# EAGLE board cblockyeesh (EAGLE 6.6.0), part 1 of 2
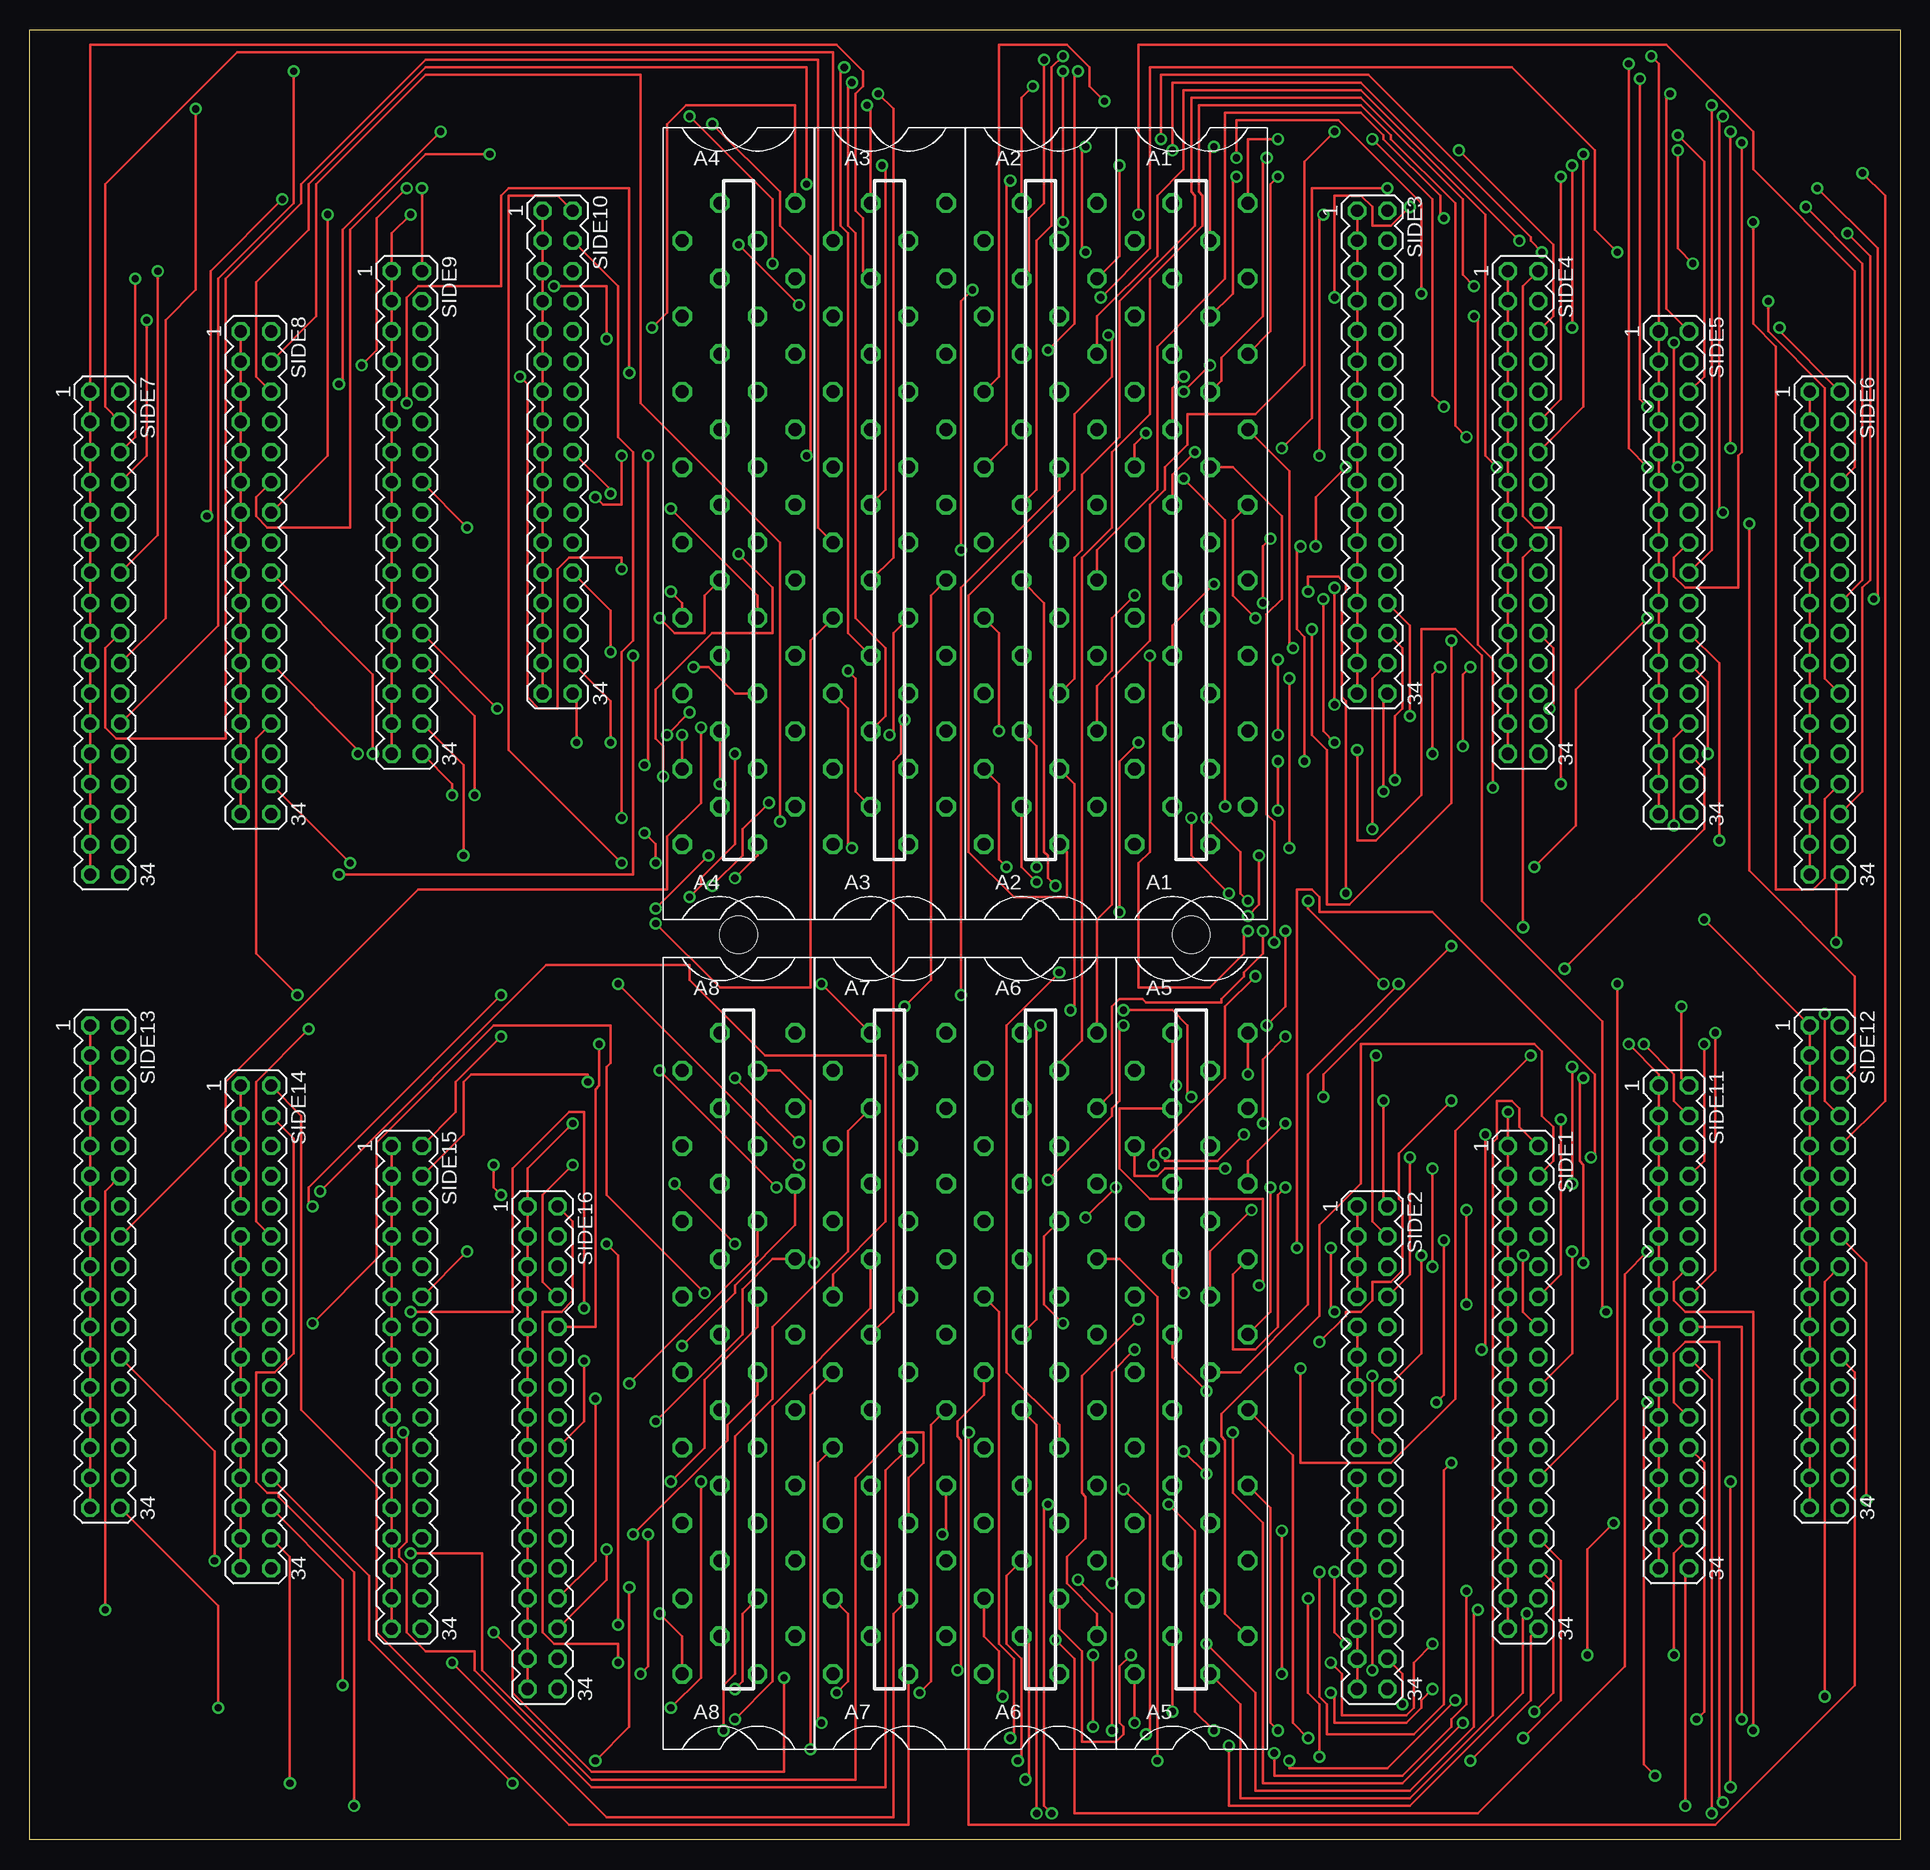
[diagram p1: board, top side]
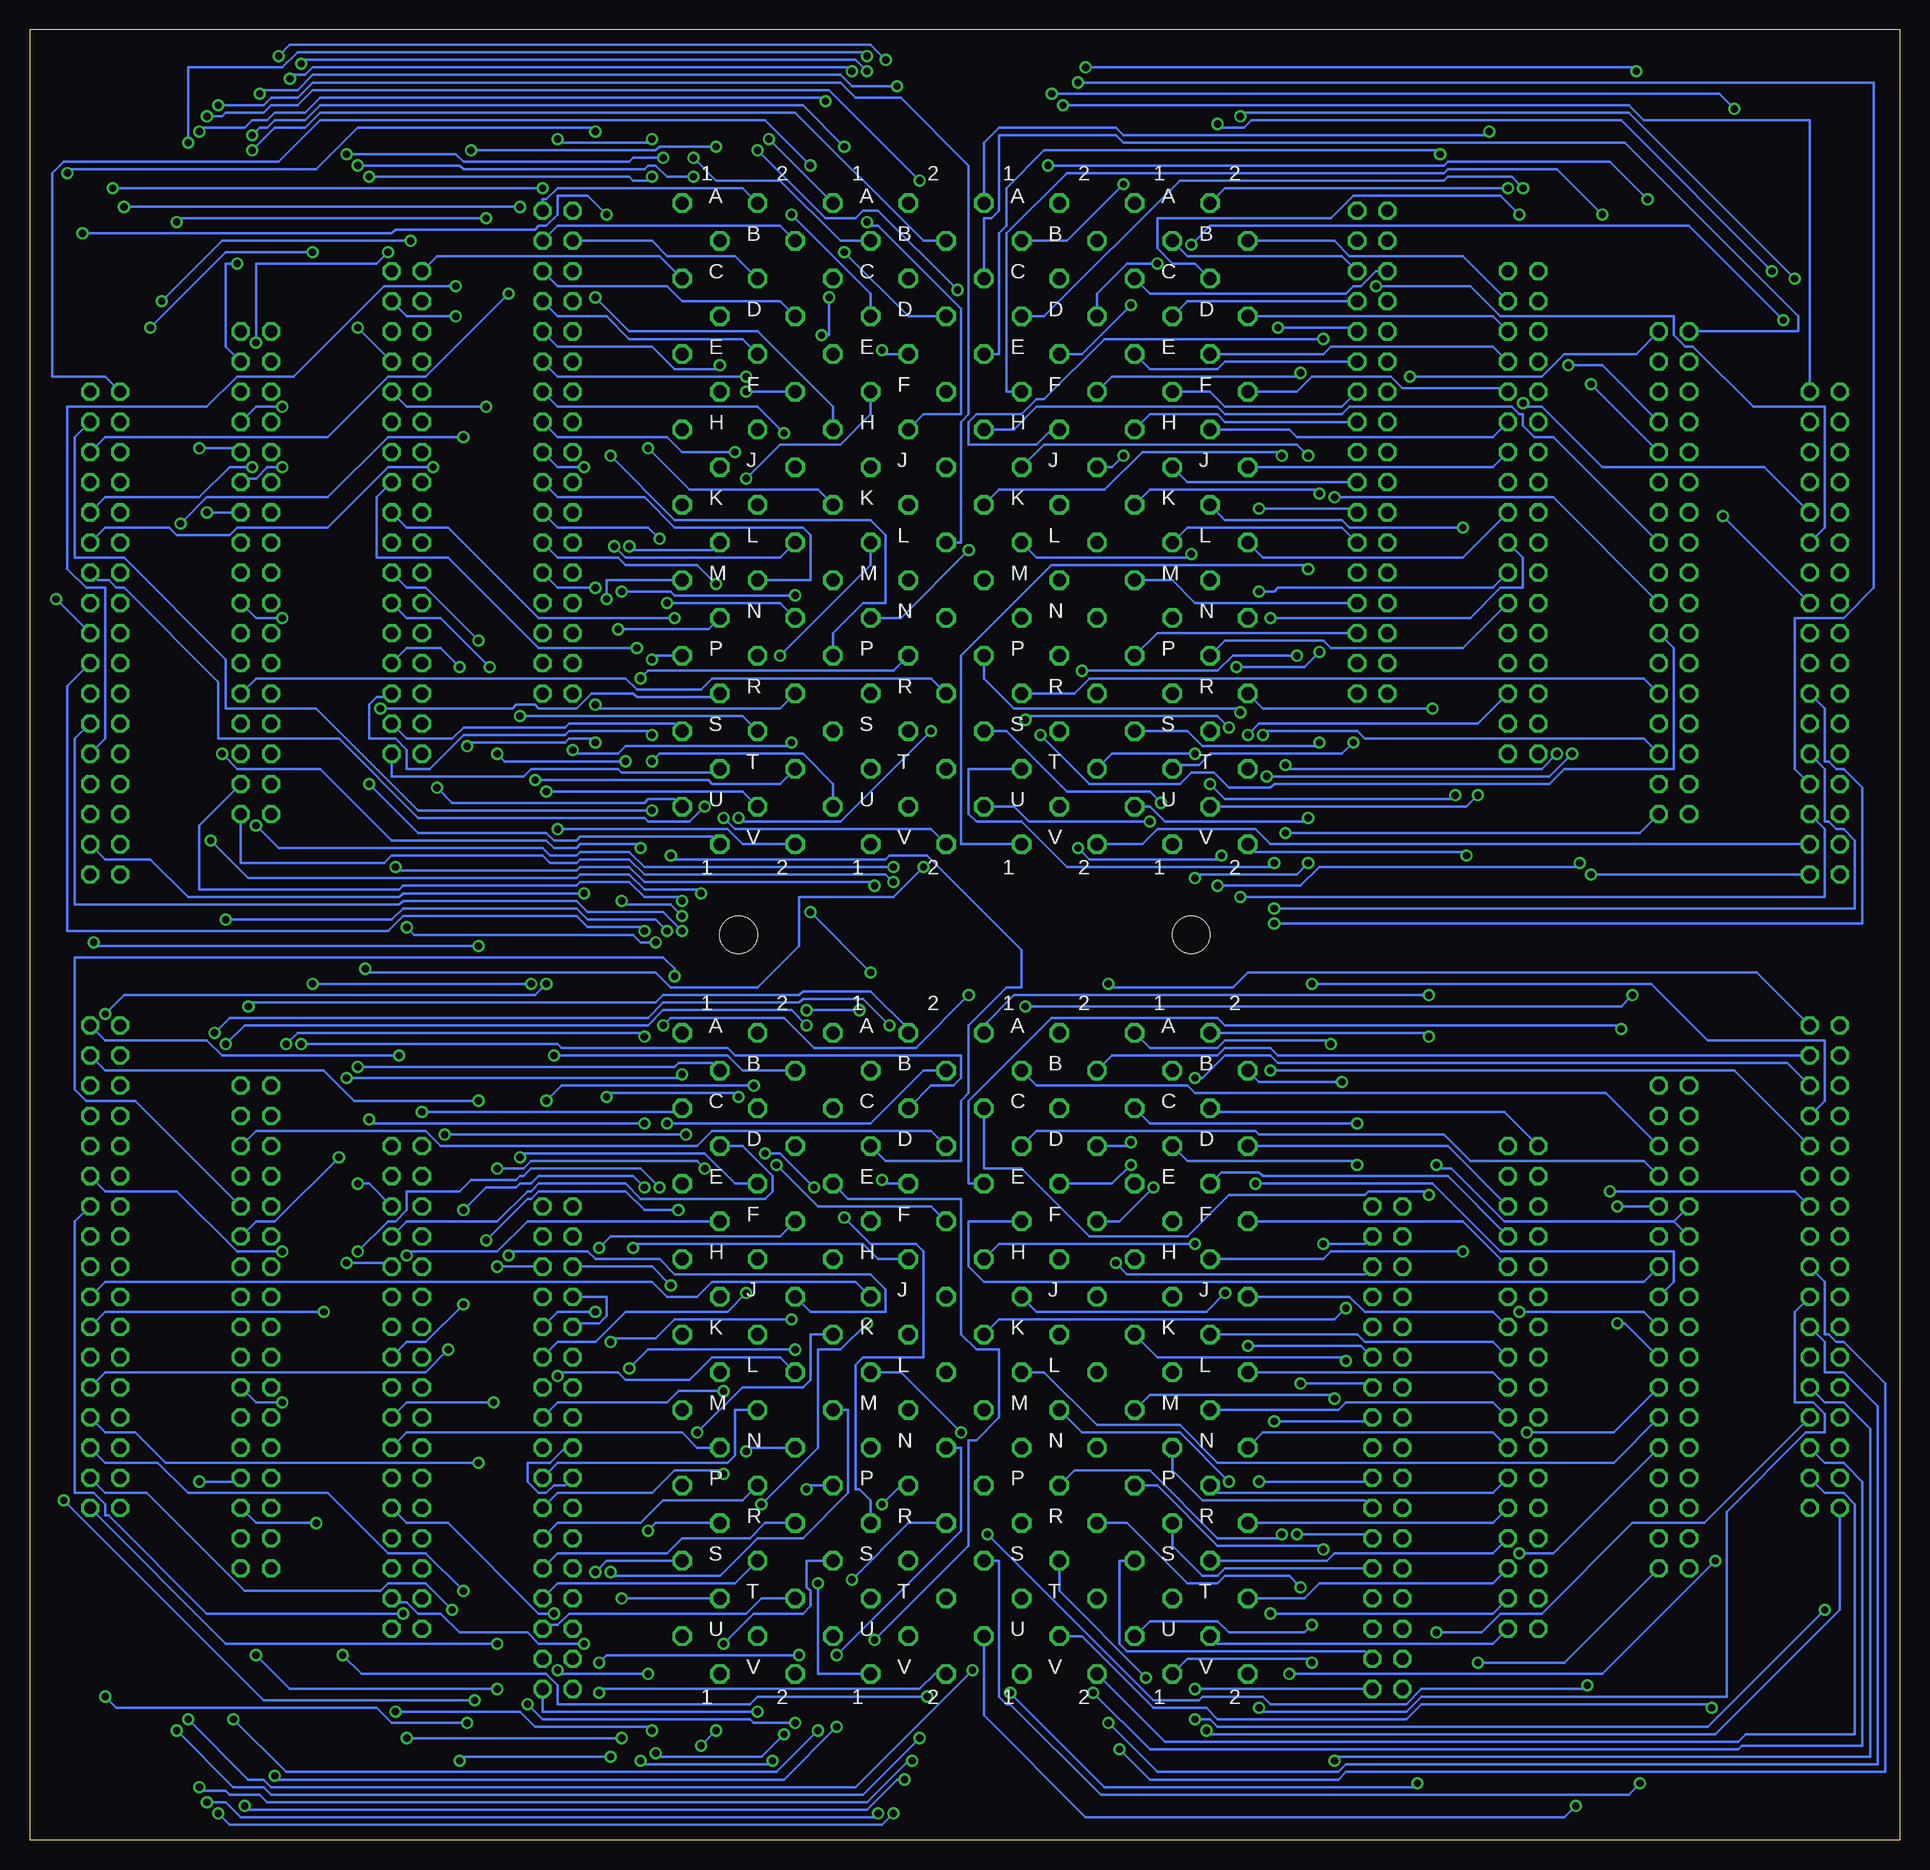
[diagram p2: board, bottom side, seen from below]

Size 157.48 x 152.4 mm. Coordinates in mm from the lower left corner, seen from the top.
Outline: 157.48,0 0,0 0,152.4 157.48,152.4 157.48,0
Copper layers (1*16): Top 0.035mm / dielectric 1.5mm / Bottom 0.035mm
Design rules "olimex8mil": minimum track width 8mil, minimum drill 24mil, track to track 8mil, track to pad 8mil, pad to pad 8mil, via to via 8mil, smd to smd 8mil, copper to edge 40mil, drill to drill 10mil, minimum pad ring 10mil, minimum via ring 8mil, stop-mask expansion 0mil, vias tented up to drill 0mil, thermal gap 10mil
Net classes: 1 Power: width 0.305 mm, clearance 0.305 mm
Holes 3.17 mm at 59.69,76.2 97.79,76.2
tKeepout: area 56.5,73 to 62.9,79.4; area 94.6,73 to 101,79.4

## Footprints (pad centres in the part's own frame; a part is rotated, then mirrored left to right if it is on the bottom)
H807 = drill 1.092 octagon: A1 4.763,28.575; A2 -1.587,28.575; B1 1.587,25.4; B2 -4.763,25.4; C1 4.763,22.225; C2 -1.587,22.225; D1 1.587,19.05; D2 -4.763,19.05; E1 4.763,15.875; E2 -1.587,15.875; F1 1.587,12.7; F2 -4.763,12.7; H1 4.763,9.525; H2 -1.587,9.525; J1 1.587,6.35; J2 -4.763,6.35; K1 4.763,3.175; K2 -1.587,3.175; L1 1.587,0; L2 -4.763,0; M1 4.763,-3.175; M2 -1.587,-3.175; N1 1.587,-6.35; N2 -4.763,-6.35; P1 4.763,-9.525; P2 -1.587,-9.525; R1 1.587,-12.7; R2 -4.763,-12.7; S1 4.763,-15.875; S2 -1.587,-15.875; T1 1.587,-19.05; T2 -4.763,-19.05; U1 4.763,-22.225; U2 -1.587,-22.225; V1 1.587,-25.4; V2 -4.763,-25.4
MA17-2 = drill 1.016 octagon: 1 -20.32,-1.27; 2 -20.32,1.27; 3 -17.78,-1.27; 4 -17.78,1.27; 5 -15.24,-1.27; 6 -15.24,1.27; 7 -12.7,-1.27; 8 -12.7,1.27; 9 -10.16,-1.27; 10 -10.16,1.27; 11 -7.62,-1.27; 12 -7.62,1.27; 13 -5.08,-1.27; 14 -5.08,1.27; 15 -2.54,-1.27; 16 -2.54,1.27; 17 0,-1.27; 18 0,1.27; 19 2.54,-1.27; 20 2.54,1.27; 21 5.08,-1.27; 22 5.08,1.27; 23 7.62,-1.27; 24 7.62,1.27; 25 10.16,-1.27; 26 10.16,1.27; 27 12.7,-1.27; 28 12.7,1.27; 29 15.24,-1.27; 30 15.24,1.27; 31 17.78,-1.27; 32 17.78,1.27; 33 20.32,-1.27; 34 20.32,1.27

## Placement (x,y rotation side)
A1  [H807]  97.79,109.22 0 top
A2  [H807]  85.09,109.22 0 top
A3  [H807]  72.39,109.22 0 top
A4  [H807]  59.69,109.22 0 top
A5  [H807]  97.79,39.37 0 top
A6  [H807]  85.09,39.37 0 top
A7  [H807]  72.39,39.37 0 top
A8  [H807]  59.69,39.37 0 top
SIDE1  [MA17-2]  125.73,38.1 270 top
SIDE2  [MA17-2]  113.03,33.02 270 top
SIDE3  [MA17-2]  113.03,116.84 270 top
SIDE4  [MA17-2]  125.73,111.76 270 top
SIDE5  [MA17-2]  138.43,106.68 270 top
SIDE6  [MA17-2]  151.13,101.6 270 top
SIDE7  [MA17-2]  6.35,101.6 270 top
SIDE8  [MA17-2]  19.05,106.68 270 top
SIDE9  [MA17-2]  31.75,111.76 270 top
SIDE10  [MA17-2]  44.45,116.84 270 top
SIDE11  [MA17-2]  138.43,43.18 270 top
SIDE12  [MA17-2]  151.13,48.26 270 top
SIDE13  [MA17-2]  6.35,48.26 270 top
SIDE14  [MA17-2]  19.05,43.18 270 top
SIDE15  [MA17-2]  31.75,38.1 270 top
SIDE16  [MA17-2]  43.18,33.02 270 top

## Tracks (layer width: path | path; a pad name or v marks a point on that pad's centre or on a via)
N$1  (via drill 0.61)
  Top 0.203: SIDE2.19 SIDE2.21 SIDE2.23 SIDE2.25 SIDE2.27 SIDE2.29 SIDE2.31 SIDE2.33 | SIDE2.17 SIDE2.15 SIDE2.13 SIDE2.11 SIDE2.9 | SIDE2.1 SIDE2.3 SIDE2.5 SIDE2.7 | A5.C2 91.76,61.59 91.76,56.52 94.3,53.98 103.82,53.98 103.82,46.99 v103.5,46.67
  Bottom 0.203: v103.5,46.67 105.09,48.26 SIDE2.5 | SIDE2.9 111.44,43.5 109.54,43.5 108.9,44.13 108.9,45.72 SIDE2.7 | SIDE2.19 112.39,29.84 113.35,29.84 113.98,29.21 114.62,29.21 115.57,30.16 115.57,31.75 113.67,31.75 112.39,33.02 SIDE2.17
N$2  (via drill 0.61)
  Top 0.203: SIDE2.2 113.98,53.66 v113.98,62.23 | v96.52,63.5 96.2,63.82 A5.A2
  Bottom 0.203: v113.98,62.23 112.71,63.5 v96.52,63.5
N$3  (via drill 0.61)
  Top 0.203: SIDE2.4 113.03,52.07 113.03,65.72 v113.35,66.04
  Bottom 0.203: v113.35,66.04 98.74,66.04 97.47,64.77 A5.B2
N$4  (via drill 0.61)
  Top 0.203: v118.11,56.52 v118.11,48.26 | v100.65,56.52 95.57,56.52 94.93,55.88 93.03,55.88 A5.D2
  Bottom 0.203: v118.11,48.26 SIDE2.6 | v118.11,56.52 115.89,56.52 115.25,57.15 101.28,57.15 v100.65,56.52
N$5  (via drill 0.61)
  Top 0.203: SIDE2.8 116.2,47.62 v116.2,57.47
  Bottom 0.203: v116.2,57.47 115.89,57.78 100.65,57.78 98.11,55.24 A5.E2
N$6  (via drill 0.61)
  Top 0.203: v109.86,44.45 109.54,44.77 v109.54,49.85
  Bottom 0.203: SIDE2.10 113.03,44.45 v109.86,44.45 | v109.54,49.85 108.58,50.8 94.3,50.8 A5.F2
N$7  (via drill 0.61)
  Top 0.203: v97.16,46.04 96.2,46.99 A5.H2
  Bottom 0.203: SIDE2.12 113.03,41.91 109.86,41.91 107.31,44.45 98.74,44.45 v97.16,46.04
N$8  (via drill 0.61)
  Top 0.203: SIDE2.14 117.16,40.96 v117.16,49.21
  Bottom 0.203: v117.16,49.21 116.84,49.53 110.49,49.53 109.86,48.9 104.46,48.9 103.19,47.62 86.68,47.62 85.41,46.35 85.41,44.45 91.76,44.45 A5.J2
N$9  (via drill 0.61)
  Top 0.203: v99.06,37.78 96.2,40.64 A5.K2
  Bottom 0.203: SIDE2.16 113.03,36.83 103.82,36.83 102.87,37.78 v99.06,37.78
N$10  (via drill 0.61)
  Top 0.203: SIDE2.18 113.03,34.29 v113.03,39.05
  Bottom 0.203: v113.03,39.05 112.71,39.37 107.95,39.37 107.31,38.73 101.92,38.73 100.01,40.64 94.3,40.64 A5.L2
N$11
  Bottom 0.203: SIDE2.20 113.03,31.75 98.74,31.75 98.11,32.38 98.11,36.2 A5.M2
N$12  (via drill 0.61)
  Top 0.203: v97.16,32.7 v99.06,30.8
  Bottom 0.203: SIDE2.22 113.03,29.21 105.09,29.21 103.19,31.11 99.38,31.11 v99.06,30.8 | v97.16,32.7 96.84,33.02 A5.N2
N$13
  Bottom 0.203: SIDE2.24 113.03,26.67 106.05,26.67 104.14,28.57 97.47,28.57 A5.P2
N$14
  Bottom 0.203: SIDE2.26 113.03,24.13 103.82,24.13 102.55,25.4 96.84,25.4 95.57,26.67 A5.R2
N$15
  Bottom 0.203: SIDE2.28 113.03,21.59 98.11,21.59 A5.S2
N$16
  Bottom 0.203: SIDE2.30 113.98,18.1 113.03,18.1 112.08,19.05 97.16,19.05 95.89,20.32 A5.T2
N$17  (via drill 0.61)
  Top 0.203: A5.U2 v96.2,10.79
  Bottom 0.203: SIDE2.34 114.3,10.79 v96.2,10.79
N$18  (via drill 0.61)
  Top 0.203: SIDE2.32 115.57,13.97 v115.57,11.43 | A5.V2 v93.03,9.84
  Bottom 0.203: v115.57,11.43 114.3,10.16 96.84,10.16 96.52,9.84 v93.03,9.84
N$19  (via drill 0.61)
  Top 0.203: v130.81,48.58 130.81,56.83 130.49,57.15 130.49,63.82 v130.81,64.14 | A5.A1 v102.55,64.45
  Bottom 0.203: SIDE1.10 127.32,48.58 v130.81,48.58 | v130.81,64.14 102.87,64.14 v102.55,64.45
N$20  (via drill 0.61)
  Top 0.203: v129.86,65.09 v129.86,55.24
  Bottom 0.203: SIDE1.6 128.91,55.24 v129.86,55.24 | v129.86,65.09 103.19,65.09 102.87,65.41 100.01,65.41 A5.B1
N$21
  Bottom 0.203: SIDE1.8 125.73,52.07 118.11,52.07 115.57,54.61 115.25,54.61 114.62,55.24 107.31,55.24 106.05,53.98 95.57,53.98 94.93,54.61 94.93,55.88 97.47,58.42 A5.D1
N$22  (via drill 0.61)
  Top 0.203: SIDE1.12 128.91,47.62 v128.91,60.64 | v105.73,60.33 102.55,57.15 A5.E1
  Bottom 0.203: v128.91,60.64 128.59,60.33 v105.73,60.33
N$23  (via drill 0.61)
  Top 0.203: SIDE1.14 125.73,44.45 v125.73,49.21
  Bottom 0.203: v125.73,49.21 125.41,49.53 118.11,49.53 115.57,52.07 A5.F1
N$24  (via drill 0.61)
  Top 0.203: v120.97,53.02 v120.97,45.09 | v105.73,54.93 105.09,54.29 105.09,43.18 103.19,41.27 101.28,41.27 101.28,47.62 A5.H1
  Bottom 0.203: SIDE1.16 125.73,41.91 124.14,41.91 v120.97,45.09 | v120.97,53.02 119.06,54.93 116.52,54.93 116.2,55.24 115.25,55.24 114.62,55.88 106.68,55.88 v105.73,54.93
N$25  (via drill 0.61)
  Top 0.203: v118.43,36.83 119.06,37.47 v119.06,50.48 | v102.87,53.02 99.38,49.53 A5.J1
  Bottom 0.203: SIDE1.20 125.73,36.83 v118.43,36.83 | v119.06,50.48 115.57,53.98 115.25,53.98 114.62,54.61 107.31,54.61 105.73,53.02 v102.87,53.02
N$26  (via drill 0.61)
  Top 0.203: SIDE1.18 129.86,40.96 v129.86,49.53 | v104.46,54.93 104.46,44.45 A5.K1
  Bottom 0.203: v129.86,49.53 127.32,52.07 126.68,52.07 125.73,53.02 125.73,54.61 121.28,54.61 120.33,55.56 116.52,55.56 116.2,55.88 115.89,55.88 115.25,56.52 106.05,56.52 v104.46,54.93
N$27  (via drill 0.61)
  Top 0.203: SIDE1.24 133.67,37.15 v133.67,72.07 | v115.25,72.07 107.63,64.45 107.63,45.09 101.92,39.37 A5.L1
  Bottom 0.203: v115.25,72.07 v133.67,72.07
N$28  (via drill 0.61)
  Top 0.203: SIDE1.28 128.91,23.5 128.91,11.75 v125.73,8.57 | v107.63,8.57 106.36,9.84 106.36,32.38 A5.M1
  Bottom 0.203: v107.63,8.57 v125.73,8.57
N$29
  Bottom 0.203: SIDE1.22 125.73,34.29 102.55,34.29 101.28,33.02 A5.N1
N$30  (via drill 0.61)
  Top 0.203: SIDE1.30 128.27,21.59 128.27,12.38 v126.68,10.79 | v105.09,9.21 104.46,9.84 104.46,27.94 A5.P1
  Bottom 0.203: v126.68,10.79 116.2,10.79 114.94,9.53 105.41,9.53 v105.09,9.21
N$31  (via drill 0.61)
  Top 0.203: v113.35,19.05 113.03,18.73 v113.03,14.29 | v105.41,26.04 v105.41,13.97
  Bottom 0.203: SIDE1.26 125.73,26.67 122.24,26.67 114.62,19.05 v113.35,19.05 | v113.03,14.29 112.71,13.97 v105.41,13.97 | v105.41,26.04 104.78,26.67 A5.R1
N$32  (via drill 0.61)
  Top 0.203: v110.81,16.51 109.86,17.46 v109.86,22.54
  Bottom 0.203: SIDE1.32 126.68,20 125.73,20 124.78,19.05 122.87,19.05 121.28,17.46 115.57,17.46 114.62,16.51 v110.81,16.51 | v109.86,22.54 108.9,23.5 A5.S1
N$33  (via drill 0.61)
  Top 0.203: SIDE1.34 126.36,17.14 126.36,11.75 v121.28,6.67 | v108.58,6.99 108.58,11.43 107.63,12.38 v107.63,20.32
  Bottom 0.203: v121.28,6.67 120.97,6.99 v108.58,6.99 | A5.T1 v107.63,20.32
N$34
  Top 0.203: SIDE1.4 128.27,57.15 128.27,60.01 127.32,60.96 127.32,66.36 126.68,66.99 112.08,66.99 112.08,55.24 108.58,51.75 108.58,44.13 100.33,35.88 100.33,33.97 100.65,33.66 100.65,19.05 A5.U1
N$35
  Top 0.203: SIDE1.2 125.41,60.01 125.41,61.59 124.78,62.23 123.51,62.23 123.51,59.05 123.19,58.74 123.19,10.48 116.2,3.49 101.92,3.49 101.92,11.43 A5.V1
N$36  (via drill 0.61)
  Top 0.203: v124.46,61.28 SIDE1.1 SIDE1.3 SIDE1.5 SIDE1.7 SIDE1.9 SIDE1.11 SIDE1.13 SIDE1.15 SIDE1.17 SIDE1.19 SIDE1.21 SIDE1.23 SIDE1.25 SIDE1.27 SIDE1.29 SIDE1.31 SIDE1.33
  Bottom 0.203: A5.C1 102.87,61.28 v124.46,61.28
N$37
  Top 0.203: SIDE3.1 SIDE3.3 SIDE3.5 SIDE3.7 SIDE3.9 SIDE3.11 SIDE3.13 SIDE3.15 SIDE3.17 SIDE3.19 SIDE3.21 SIDE3.23 SIDE3.25 SIDE3.27 SIDE3.29 SIDE3.31 SIDE3.33
  Bottom 0.203: A1.C2 98.11,133.35 103.82,133.35 105.09,134.62 SIDE3.3
N$38
  Bottom 0.203: SIDE3.2 114.3,138.11 113.98,138.11 113.03,139.06 97.47,139.06 A1.A2
N$39
  Bottom 0.203: SIDE3.4 113.03,135.89 94.3,135.89 A1.B2
N$40
  Bottom 0.203: SIDE3.6 113.03,130.81 103.82,130.81 102.55,129.54 94.3,129.54 A1.D2
N$41
  Bottom 0.203: SIDE3.8 113.03,128.27 108.9,128.27 107,126.36 97.47,126.36 A1.E2
N$42  (via drill 0.61)
  Top 0.203: v97.16,121.92 v99.38,124.14
  Bottom 0.203: SIDE3.10 113.03,125.73 105.09,125.73 103.19,123.83 99.69,123.83 v99.38,124.14 | A1.F2 v97.16,121.92
N$43  (via drill 0.61)
  Top 0.203: v97.16,123.19 96.2,122.24 A1.H2
  Bottom 0.203: SIDE3.12 113.03,123.19 v97.16,123.19
N$44  (via drill 0.61)
  Top 0.203: v93.98,118.43 93.03,117.47 A1.J2
  Bottom 0.203: SIDE3.14 113.03,120.65 96.2,120.65 v93.98,118.43
N$45  (via drill 0.61)
  Top 0.203: v98.11,116.84 96.2,114.94 A1.K2
  Bottom 0.203: SIDE3.16 113.03,118.11 103.82,118.11 102.55,116.84 v98.11,116.84
N$46  (via drill 0.61)
  Top 0.203: v110.81,115.57 108.27,113.03 v108.27,108.9
  Bottom 0.203: SIDE3.18 113.03,115.57 v110.81,115.57 | v108.27,108.9 107.31,107.95 94.3,107.95 A1.L2
N$47
  Bottom 0.203: SIDE3.20 113.03,113.03 105.73,113.03 103.19,110.49 92.39,110.49 91.76,109.86 91.76,106.05 A1.M2
N$48  (via drill 0.61)
  Top 0.203: v104.46,109.54 103.82,108.9 v103.82,104.14
  Bottom 0.203: SIDE3.22 113.03,110.49 105.41,110.49 v104.46,109.54 | v103.82,104.14 94.3,104.14 A1.N2
N$49  (via drill 0.61)
  Top 0.203: v99.69,105.73 96.2,102.23 A1.P2
  Bottom 0.203: SIDE3.24 113.03,107.95 107.95,107.95 107.31,107.31 101.28,107.31 v99.69,105.73
N$50  (via drill 0.61)
  Top 0.203: v109.86,95.57 v109.86,105.41
  Bottom 0.203: SIDE3.26 113.03,105.41 v109.86,105.41 | v109.86,95.57 109.54,95.25 94.3,95.25 A1.R2
N$51  (via drill 0.61)
  Top 0.203: SIDE3.28 116.2,102.23 v116.2,94.61
  Bottom 0.203: v116.2,94.61 97.47,94.61 A1.S2
N$52  (via drill 0.61)
  Top 0.203: SIDE3.30 115.57,100.33 115.57,95.25 114.94,94.61 v114.94,89.22
  Bottom 0.203: v114.94,89.22 100.33,89.22 100.01,88.9 94.3,88.9 A1.T2
N$53  (via drill 0.61)
  Top 0.203: SIDE3.34 113.98,96.2 v113.98,88.27
  Bottom 0.203: v113.98,88.27 97.47,88.27 A1.U2
N$54  (via drill 0.61)
  Top 0.203: SIDE3.32 113.03,97.79 v113.03,85.09
  Bottom 0.203: v113.03,85.09 98.74,85.09 97.47,83.82 A1.V2
N$55  (via drill 0.61)
  Top 0.203: v119.06,120.65 118.11,121.6 118.11,138.11 v113.03,143.19 | v105.09,143.19 102.55,143.19 A1.A1
  Bottom 0.203: SIDE4.10 125.73,120.65 v119.06,120.65 | v113.03,143.19 112.71,142.88 105.41,142.88 v105.09,143.19
N$56  (via drill 0.61)
  Top 0.203: SIDE4.6 128.27,128.27 128.27,134.3 v120.33,142.24 | v99.69,142.56 99.38,142.24 A1.B1
  Bottom 0.203: v120.33,142.24 104.78,142.24 104.46,142.56 v99.69,142.56
N$57  (via drill 0.61)
  Top 0.203: v129.86,140.97 v129.86,127.32 | v101.6,140.02 101.28,139.7 101.28,130.18 A1.D1
  Bottom 0.203: v129.86,127.32 SIDE4.8 | v129.86,140.97 121.28,140.97 120.97,140.65 105.73,140.65 105.41,140.97 104.78,140.97 103.82,140.02 v101.6,140.02
N$58  (via drill 0.61)
  Top 0.203: SIDE4.12 128.91,121.28 v128.91,140.02 | v105.09,140.02 104.46,139.38 104.46,127 A1.E1
  Bottom 0.203: v128.91,140.02 107,140.02 106.68,139.7 105.41,139.7 v105.09,140.02
N$59  (via drill 0.61)
  Top 0.203: SIDE4.14 130.81,120.65 v130.81,141.92 | v104.14,141.6 103.82,141.29 103.82,128.27 100.33,124.78 100.33,122.87 A1.F1
  Bottom 0.203: v130.81,141.92 121.6,141.92 120.97,141.29 107,141.29 106.68,141.6 v104.14,141.6
N$60  (via drill 0.61)
  Top 0.203: v106.36,100.33 106.05,100.65 106.05,115.25 A1.H1
  Bottom 0.203: SIDE4.16 128.27,113.03 128.27,107.95 122.24,107.95 114.62,100.33 v106.36,100.33
N$61  (via drill 0.61)
  Top 0.203: SIDE4.20 125.73,107.95 v125.73,76.83 | v104.78,75.56 104.78,85.72 104.14,86.36 104.14,103.19 105.41,104.46 105.41,111.44 101.28,115.57 A1.J1
  Bottom 0.203: v125.73,76.83 125.09,76.2 106.68,76.2 106.05,75.56 v104.78,75.56
N$62  (via drill 0.61)
  Top 0.203: v103.19,102.87 101.28,104.78 101.28,111.12 A1.K1
  Bottom 0.203: SIDE4.18 125.73,110.49 122.24,110.49 114.62,102.87 v103.19,102.87
N$63  (via drill 0.61)
  Top 0.203: v118.75,98.74 118.11,98.11 v118.11,91.44 | v107.31,90.81 107.31,101.28 106.68,101.92 106.68,108.58 v107,108.9
  Bottom 0.203: SIDE4.24 125.73,102.87 122.87,102.87 v118.75,98.74 | v118.11,91.44 117.47,90.81 v107.31,90.81 | v107,108.9 106.68,108.58 100.01,108.58 A1.L1
N$64  (via drill 0.61)
  Top 0.203: v121.28,98.74 120.65,98.11 v120.65,92.08 | v109.86,92.39 108.9,93.34 v108.9,104.46
  Bottom 0.203: SIDE4.28 125.73,100.33 122.87,100.33 v121.28,98.74 | v120.65,92.08 120.33,92.39 112.39,92.39 112.08,92.71 110.17,92.71 v109.86,92.39 | v108.9,104.46 108.9,106.05 A1.M1
N$65  (via drill 0.61)
  Top 0.203: v119.7,100.97 119.7,87.31 111.12,78.74 109.22,78.74 109.22,91.76 107.95,93.03 v107.95,101.92
  Bottom 0.203: SIDE4.22 125.73,105.41 124.14,105.41 v119.7,100.97 | v107.95,101.92 100.33,101.92 A1.N1
N$66  (via drill 0.61)
  Top 0.203: v105.09,99.38 v105.09,93.03
  Bottom 0.203: SIDE4.30 127.32,96.2 128.27,96.2 128.91,95.57 128.91,92.71 126.68,92.71 125.73,91.76 125.73,90.17 123.83,90.17 120.97,93.03 112.39,93.03 112.08,93.34 105.41,93.34 v105.09,93.03 | v105.09,99.38 104.78,99.69 A1.P1
N$67  (via drill 0.61)
  Top 0.203: SIDE4.26 128.27,100.33 128.27,95.57 v127.95,95.25
  Bottom 0.203: v127.95,95.25 116.84,95.25 116.52,95.57 114.94,95.57 114.62,95.25 111.44,95.25 110.17,96.52 106.68,96.52 106.36,96.2 99.69,96.2 A1.R1
N$68
  Bottom 0.203: SIDE4.32 125.73,92.71 121.92,92.71 120.97,93.66 112.39,93.66 112.08,93.98 103.19,93.98 A1.S1
N$69
  Bottom 0.203: SIDE4.34 127,89.53 115.89,89.53 115.25,90.17 107.95,90.17 107.63,89.85 99.69,89.85 A1.T1
N$70  (via drill 0.61)
  Top 0.203: v121.6,128.27 121.92,127.95 121.92,100.65 123.19,99.38 v123.19,88.58
  Bottom 0.203: SIDE4.4 125.73,128.27 v121.6,128.27 | v123.19,88.58 121.92,87.31 105.73,87.31 105.41,87.63 103.19,87.63 A1.U1
N$71  (via drill 0.61)
  Top 0.203: SIDE4.2 125.73,130.81 125.73,111.44 126.68,110.49 128.91,110.49 v128.91,88.9
  Bottom 0.203: v128.91,88.9 124.78,84.77 113.98,84.77 113.35,84.14 111.44,84.14 111.12,84.45 100.01,84.45 A1.V1
N$72
  Top 0.203: SIDE4.1 SIDE4.3 SIDE4.5 SIDE4.7 SIDE4.9 SIDE4.11 SIDE4.13 SIDE4.15 SIDE4.17 SIDE4.19 SIDE4.21 SIDE4.23 SIDE4.25 SIDE4.27 SIDE4.29 SIDE4.31 SIDE4.33
  Bottom 0.203: A1.C1 104.46,133.35 123.19,133.35 SIDE4.1
N$73  (via drill 0.61)
  Top 0.203: SIDE5.33 SIDE5.31 SIDE5.29 SIDE5.27 SIDE5.25 SIDE5.23 SIDE5.21 SIDE5.19 SIDE5.17 SIDE5.15 SIDE5.13 SIDE5.11 SIDE5.9 SIDE5.7 SIDE5.5 SIDE5.3 SIDE5.1 137.16,149.54 v136.53,150.18 | A2.C2 84.14,132.08 84.14,136.53 85.41,137.79 v85.41,149.86
  Bottom 0.203: v85.41,149.86 86.68,151.13 135.57,151.13 v136.53,150.18
N$74  (via drill 0.61)
  Top 0.203: SIDE5.2 137.79,128.91 137.79,146.69 v138.11,147 | v84.45,147.64 83.5,146.69 A2.A2
  Bottom 0.203: v138.11,147 137.79,147.32 134.94,147.32 133.67,148.59 89.22,148.59 88.27,147.64 v84.45,147.64
N$75  (via drill 0.61)
  Top 0.203: v140.02,132.72 138.75,133.99 v138.75,142.24
  Bottom 0.203: SIDE5.4 140.97,125.73 140.97,132.72 v140.02,132.72 | v138.75,142.24 136.84,144.15 134.3,144.15 133.03,145.41 93.03,145.41 82.23,134.62 A2.B2
N$76  (via drill 0.61)
  Top 0.203: SIDE5.6 140.97,123.19 140.97,141.29 v138.75,143.51 | v88.9,142.56 88.58,142.24 88.58,133.99 v88.9,133.67
  Bottom 0.203: v138.75,143.51 138.11,144.15 137.48,144.15 136.84,144.78 134.3,144.78 133.03,146.05 92.39,146.05 v88.9,142.56 | v88.9,133.67 83.5,128.27 A2.D2
N$77  (via drill 0.61)
  Top 0.203: v136.21,120.65 135.57,121.28 v135.57,148.27 | v88.27,148.91 87.95,148.59 87.95,127.64 v85.72,125.41
  Bottom 0.203: SIDE5.8 138.43,120.65 v136.21,120.65 | v135.57,148.27 135.25,148.59 134.3,148.59 133.67,149.22 88.58,149.22 v88.27,148.91 | v85.72,125.41 85.41,125.09 A2.E2
N$78  (via drill 0.61)
  Top 0.203: v143.19,143.83 v143.19,117.16 | v90.49,146.37 89.22,147.64 89.22,149.22 87.31,151.13 81.6,151.13 81.6,123.19 A2.F2
  Bottom 0.203: SIDE5.10 140.02,117.16 v143.19,117.16 | v143.19,143.83 142.88,144.15 139.38,144.15 138.75,144.78 137.48,144.78 136.84,145.41 134.3,145.41 133.03,146.69 90.81,146.69 v90.49,146.37
N$79  (via drill 0.61)
  Top 0.203: v136.21,115.57 134.62,117.16 v134.62,149.54 | v87,136.21 v87,148.91
  Bottom 0.203: SIDE5.12 139.38,114.62 138.43,114.62 137.48,115.57 v136.21,115.57 | v134.62,149.54 134.3,149.86 87.95,149.86 v87,148.91 | v87,136.21 86.68,135.89 86.04,135.89 79.06,128.91 79.06,120.02 82.23,120.02 A2.H2
N$80  (via drill 0.61)
  Top 0.203: v142.56,111.76 142.24,112.08 142.24,144.78 v142.56,145.1 | v82.55,139.7 82.23,139.38 82.23,117.47 A2.J2
  Bottom 0.203: v142.56,111.76 SIDE5.14 | v142.56,145.1 141.29,145.1 140.97,145.41 137.79,145.41 137.16,146.05 134.94,146.05 133.67,147.32 90.17,147.32 v82.55,139.7
N$81  (via drill 0.61)
  Top 0.203: SIDE5.16 138.43,107.95 138.43,106.36 139.38,105.41 143.83,105.41 143.83,116.52 144.15,116.84 v144.15,142.88 | v87,150.18 86.04,149.22 86.04,135.89 84.77,134.62 84.77,113.67 A2.K2
  Bottom 0.203: v144.15,142.88 144.15,149.22 136.21,149.22 134.94,150.5 87.31,150.5 v87,150.18
N$82  (via drill 0.61)
  Top 0.203: SIDE5.18 141.6,108.58 v141.6,146.05
  Bottom 0.203: v141.6,146.05 137.79,146.05 137.16,146.69 134.94,146.69 133.67,147.96 89.22,147.96 87.95,146.69 84.14,146.69 78.42,140.97 78.42,120.02 79.06,119.38 79.06,109.22 A2.L2
N$83  (via drill 0.61)
  Top 0.203: v136.21,102.87 130.18,96.84 130.18,85.41 v126.68,81.92 | v86.36,80.33 85.72,80.96 85.72,82.87 85.41,83.19 85.41,104.14 A2.M2
  Bottom 0.203: SIDE5.20 138.43,102.87 v136.21,102.87 | v126.68,81.92 126.36,81.6 111.44,81.6 111.12,81.92 107,81.92 105.73,80.64 86.68,80.64 v86.36,80.33
N$84  (via drill 0.61)
  Top 0.203: SIDE5.22 142.24,99.06 v142.24,84.14 | v100.97,79.69 97.79,82.87 v97.79,86.04 | v81.6,93.34 81.6,101.6 A2.N2
  Bottom 0.203: v142.24,84.14 139.06,80.96 111.44,80.96 111.12,81.28 107,81.28 105.73,80.01 101.28,80.01 v100.97,79.69 | v97.79,86.04 97.47,85.72 89.22,85.72 v81.6,93.34
N$85  (via drill 0.61)
  Top 0.203: SIDE5.24 141.29,97.47 v141.29,91.44 | v106.05,97.79 v106.05,83.5
  Bottom 0.203: v141.29,91.44 140.02,90.17 133.03,90.17 127,84.14 113.98,84.14 113.35,83.5 111.44,83.5 111.12,83.82 106.36,83.82 v106.05,83.5 | v106.05,97.79 105.41,98.42 84.77,98.42 A2.P2
N$86
  Bottom 0.203: SIDE5.26 138.43,97.79 107.31,97.79 106.36,96.84 100.97,96.84 100.01,97.79 81.6,97.79 A2.R2
N$87  (via drill 0.61)
  Top 0.203: SIDE5.28 138.43,92.71 v138.43,85.41 | v84.77,81.92 84.77,92.08 A2.S2
  Bottom 0.203: v138.43,85.41 136.53,83.5 114.3,83.5 113.67,82.87 111.44,82.87 111.12,83.19 107,83.19 105.73,81.92 v84.77,81.92
N$88  (via drill 0.61)
  Top 0.203: SIDE5.30 140.97,90.17 140.97,85.09 v129.22,73.34 | v82.23,81.92 81.6,82.55 81.6,88.9 A2.T2
  Bottom 0.203: v129.22,73.34 128.91,73.03 104.78,73.03 103.5,71.75 96.2,71.75 92.71,75.25 92.71,79.38 84.77,79.38 v82.23,81.92
N$89  (via drill 0.61)
  Top 0.203: v84.77,80.64 83.5,81.92 A2.U2
  Bottom 0.203: SIDE5.34 139.7,82.23 127.64,82.23 127,82.87 114.3,82.87 113.67,82.23 111.44,82.23 111.12,82.55 107,82.55 105.73,81.28 85.41,81.28 v84.77,80.64
N$90  (via drill 0.61)
  Top 0.203: v102.55,79.06 101.92,79.69 101.92,83.19 v99.06,86.04
  Bottom 0.203: SIDE5.32 143.19,85.41 143.19,80.01 126.36,80.01 126.05,80.33 111.44,80.33 111.12,80.64 107,80.64 105.73,79.38 102.87,79.38 v102.55,79.06 | v99.06,86.04 98.11,85.09 81.6,85.09 A2.V2
N$91  (via drill 0.61)
  Top 0.203: v138.75,115.57 138.43,115.89 v138.43,126.05 | v127.32,133.67 126.36,134.62 126.36,134.94 112.71,148.59 95.25,148.59 v95.25,143.19
  Bottom 0.203: SIDE6.10 151.13,113.03 143.19,113.03 140.65,115.57 v138.75,115.57 | v138.43,126.05 138.43,132.72 128.27,132.72 v127.32,133.67 | A2.A1 v95.25,143.19
N$92  (via drill 0.61)
  Top 0.203: v117.16,130.18 117.16,137.79 110.17,144.78 101.6,144.78 v101.6,141.6
  Bottom 0.203: SIDE6.6 151.13,118.11 132.4,118.11 127.32,123.19 124.14,123.19 v117.16,130.18 | v101.6,141.6 99.69,139.7 94.3,139.7 89.22,134.62 A2.B1
N$93  (via drill 0.61)
  Top 0.203: SIDE6.8 153.67,115.57 153.67,132.08 145.1,140.65 145.1,143.83 137.79,151.13 93.34,151.13 v93.34,136.84
  Bottom 0.203: v93.34,136.84 86.68,130.18 A2.D1
N$94  (via drill 0.61)
  Top 0.203: v123.51,115.57 122.56,116.52 122.56,136.84 112.08,147.32 97.16,147.32 97.16,140.65 94.93,138.43 94.93,133.35 89.85,128.27 A2.E1
  Bottom 0.203: SIDE6.12 151.13,110.49 145.73,110.49 145.1,109.86 140.65,109.86 140.02,110.49 132.4,110.49 127.32,115.57 v123.51,115.57
N$95  (via drill 0.61)
  Top 0.203: v100.65,87 100.65,111.12 v97.16,114.62
  Bottom 0.203: SIDE6.14 151.76,106.05 150.81,106.05 150.18,105.41 149.54,105.41 141.6,97.47 141.6,92.71 131.44,92.71 124.78,86.04 105.73,86.04 105.41,85.72 101.92,85.72 v100.65,87 | v97.16,114.62 94.3,117.47 89.22,117.47 86.68,120.02 A2.F1
N$96  (via drill 0.61)
  Top 0.203: SIDE6.16 154.31,106.05 154.31,132.72 v149.54,137.48 | v116.2,137.48 114.62,135.89 113.03,135.89 113.03,137.48 112.08,138.43 109.86,138.43 v109.86,129.86
  Bottom 0.203: v116.2,137.48 v149.54,137.48 | v109.86,129.86 107,127 96.2,127 89.85,120.65 A2.H1
N$97  (via drill 0.61)
  Top 0.203: v105.73,76.52 105.73,70.17 v104.14,68.58 | v78.42,71.12 78.42,105.41 86.68,113.67 A2.J1
  Bottom 0.203: SIDE6.20 154.31,97.16 154.31,76.52 127.32,76.52 126.05,77.79 111.44,77.79 110.49,76.83 106.05,76.83 v105.73,76.52 | v104.14,68.58 103.5,69.22 93.98,69.22 91.44,66.67 82.87,66.67 v78.42,71.12
N$98  (via drill 0.61)
  Top 0.203: v155.26,104.46 155.57,104.78 155.57,133.99 v150.5,139.06 | v114.3,139.06 107.95,139.06 107.95,119.7 v105.41,117.16
  Bottom 0.203: v155.26,104.46 SIDE6.18 | v114.3,139.06 v150.5,139.06 | v105.41,117.16 101.92,113.67 91.12,113.67 A2.K1
N$99  (via drill 0.61)
  Top 0.203: v102.55,76.52 102.23,76.2 102.23,74.61 99.38,71.75 93.34,71.75 93.34,82.23 94.3,83.19 v94.3,99.69
  Bottom 0.203: SIDE6.24 153.67,92.71 153.67,78.74 126.36,78.74 126.05,79.06 111.44,79.06 110.49,78.11 104.14,78.11 v102.55,76.52 | v94.3,99.69 86.68,107.31 A2.L1
N$100  (via drill 0.61)
  Top 0.203: SIDE6.28 151.13,87.63 151.13,80.96 150.18,80.01 147,80.01 147,125.73 145.1,127.64 v145.1,136.21 | v119.06,136.53 118.75,136.84 118.75,138.43 113.98,143.19 113.98,143.51 112.08,145.41 100.65,145.41 100.65,131.44 94.93,125.73 94.93,113.67 89.85,108.58 A2.M1
  Bottom 0.203: v145.1,136.21 144.78,136.53 v119.06,136.53
N$101  (via drill 0.61)
  Top 0.203: SIDE6.22 151.13,97.79 151.13,122.24 146.37,127 v146.37,129.54 | v125.41,134.62 112.08,147.96 96.2,147.96 v96.2,142.24 | v79.38,130.49 78.42,129.54 v78.42,108.58
  Bottom 0.203: v146.37,129.54 141.29,134.62 v125.41,134.62 | v96.2,142.24 90.49,136.53 87.95,136.53 87.31,137.16 86.04,137.16 v79.38,130.49 | v78.42,108.58 84.14,102.87 A2.N1
N$102  (via drill 0.61)
  Top 0.203: SIDE6.30 154.31,88.27 154.31,105.41 154.94,106.05 154.94,133.35 v153.03,135.25 | v108.9,136.84 108.58,136.53 v108.58,116.52
  Bottom 0.203: v153.03,135.25 127,135.25 126.68,135.57 114.94,135.57 114.62,135.89 113.98,135.89 113.03,136.84 113.03,138.43 110.49,138.43 v108.9,136.84 | v108.58,116.52 103.19,111.12 86.68,111.12 85.41,109.86 85.41,104.14 87.31,104.14 89.85,101.6 A2.P1
N$103  (via drill 0.61)
  Top 0.203: v121.6,130.81 120.65,131.76 120.65,138.11 112.08,146.69 97.79,146.69 97.79,138.75 98.11,138.43 98.11,135.89 91.76,129.54 91.76,118.11 88.58,114.94 88.58,108.58 87.95,107.95 87.95,97.79 A2.R1
  Bottom 0.203: SIDE6.26 151.13,92.71 151.13,105.41 152.72,105.41 154.31,107 154.31,120.65 142.56,120.65 140.02,123.19 135.25,123.19 127.64,130.81 v121.6,130.81
N$104  (via drill 0.61)
  Top 0.203: v110.81,79.69 110.81,95.89 110.49,96.2 110.49,104.78 110.81,105.09 110.81,105.73 110.17,106.36 107.63,106.36 v107.63,105.09 | v93.03,104.78 91.12,102.87 91.12,98.42 89.85,97.16 A2.S1
  Bottom 0.203: SIDE6.32 151.13,82.55 147.32,82.55 144.15,79.38 126.36,79.38 126.05,79.69 v110.81,79.69 | v107.63,105.09 103.5,105.09 103.19,104.78 v93.03,104.78
N$105  (via drill 0.61)
  Top 0.203: SIDE6.34 152.08,80.96 v152.08,75.56 | v119.7,75.25 108.9,64.45 v108.9,62.55 | v97.79,62.55 97.47,62.87 97.47,68.58 96.2,69.85 v92.08,69.85 | v87.63,69.85 87.95,70.17 87.95,88.9 A2.T1
  Bottom 0.203: v152.08,75.56 151.76,75.25 v119.7,75.25 | v108.9,62.55 108.58,62.87 98.11,62.87 v97.79,62.55 | v87.63,69.85 v92.08,69.85
N$106  (via drill 0.61)
  Top 0.203: v105.09,90.81 v105.09,86.68
  Bottom 0.203: SIDE6.4 153.67,118.11 153.67,107.95 149.54,107.95 140.97,99.38 140.97,95.25 133.35,95.25 124.78,86.68 v105.09,86.68 | v105.09,90.81 104.46,91.44 92.39,91.44 89.85,88.9 A2.U1
N$107  (via drill 0.61)
  Top 0.203: SIDE6.2 147.32,127 v147.32,127.32 | v133.67,133.67 131.76,135.57 131.76,142.24 124.78,149.22 94.3,149.22 94.3,133.99 v90.17,129.86 | v90.81,126.68 91.12,126.36 91.12,123.19 87.95,120.02 87.95,113.67 79.06,104.78 79.06,83.19 82.87,79.38 87.31,79.38 87.31,83.19 A2.V1
  Bottom 0.203: v147.32,127.32 140.97,133.67 v133.67,133.67 | v90.17,129.86 90.17,126.68 v90.81,126.68
N$108  (via drill 0.61)
  Top 0.203: SIDE6.33 SIDE6.31 SIDE6.29 SIDE6.27 SIDE6.25 SIDE6.23 SIDE6.21 SIDE6.19 SIDE6.17 SIDE6.15 SIDE6.13 SIDE6.11 SIDE6.9 SIDE6.7 SIDE6.5 SIDE6.3 SIDE6.1 | A2.C1 91.76,133.35 v91.76,140.97
  Bottom 0.203: v91.76,140.97 95.57,144.78 133.03,144.78 136.53,141.29 154.62,141.29 155.57,140.34 155.57,123.19 151.13,123.19 SIDE6.1
N$109
  Top 0.203: SIDE7.33 SIDE7.31 SIDE7.29 SIDE7.27 SIDE7.25 SIDE7.23 SIDE7.21 SIDE7.19 SIDE7.17 SIDE7.15 SIDE7.13 SIDE7.11 SIDE7.9 SIDE7.7 SIDE7.5 SIDE7.3 SIDE7.1 5.08,151.13 67.94,151.13 70.17,148.91 70.17,147.64 69.53,147 69.53,137.16 70.17,136.53 70.17,132.08 A3.C2
N$110  (via drill 0.61)
  Top 0.203: v70.48,146.05 70.8,145.73 A3.A2
  Bottom 0.203: SIDE7.2 7.62,144.78 21.59,144.78 22.86,146.05 v70.48,146.05
N$111
  Top 0.203: SIDE7.4 6.35,120.65 6.35,139.38 17.46,150.5 67.63,150.5 A3.B2
N$112  (via drill 0.61)
  Top 0.203: SIDE7.6 8.89,118.11 v8.89,131.44 | v55.56,145.1 62.55,138.11 v62.55,132.72
  Bottom 0.203: v8.89,131.44 22.86,145.41 55.24,145.41 v55.56,145.1 | v62.55,132.72 65.09,132.72 67.63,130.18 A3.D2
N$113  (via drill 0.61)
  Top 0.203: SIDE7.8 9.84,116.52 v9.84,127.95 | v64.77,129.22 v59.69,134.3
  Bottom 0.203: v9.84,127.95 17.78,135.89 58.1,135.89 v59.69,134.3 | v64.77,129.22 68.9,125.09 A3.E2
N$114  (via drill 0.61)
  Top 0.203: v31.75,120.97 31.75,129.86 32.7,130.81 39.69,130.81 39.69,138.43 40.32,139.06 50.48,139.06 v50.48,123.51
  Bottom 0.203: SIDE7.10 11.43,115.57 25.08,115.57 30.16,120.65 31.43,120.65 v31.75,120.97 | v50.48,123.51 50.8,123.19 66.36,123.19 A3.F2
N$115  (via drill 0.61)
  Top 0.203: v44.13,130.81 48.58,130.81 v48.58,126.36
  Bottom 0.203: SIDE7.12 6.35,110.49 6.35,120.65 12.38,120.65 17.46,125.73 18.1,125.73 19.05,126.68 19.05,128.27 33.66,128.27 36.2,130.81 v44.13,130.81 | v48.58,126.36 66.99,126.36 72.07,121.28 72.71,121.28 73.98,120.02 77.79,120.02 78.42,119.38 78.42,117.47 72.71,117.47 71.44,118.75 A3.H2
N$116  (via drill 0.61)
  Top 0.203: SIDE7.14 10.79,109.86 v10.79,132.08 | v57.47,144.46 63.18,138.75 63.18,135.89 65.72,133.35 65.72,116.84 v65.41,116.52
  Bottom 0.203: v10.79,132.08 23.5,144.78 54.61,144.78 55.24,144.15 57.15,144.15 v57.47,144.46 | v65.41,116.52 66.36,115.57 A3.J2
N$117  (via drill 0.61)
  Top 0.203: v14.92,111.44 15.24,111.76 15.24,132.08 v21.27,138.11 | v71.75,140.97 72.07,140.65 72.07,113.67 A3.K2
  Bottom 0.203: v14.92,111.44 SIDE7.16 | v21.27,138.11 24.45,141.29 38.1,141.29 38.42,140.97 v71.75,140.97
N$118
  Top 0.203: SIDE7.18 6.35,100.33 6.35,93.66 7.3,92.71 16.51,92.71 16.51,131.44 22.86,137.79 22.86,139.38 33.34,149.86 66.36,149.86 66.36,110.49 A3.L2
N$119  (via drill 0.61)
  Top 0.203: SIDE7.20 11.43,102.87 11.43,127.95 13.97,130.49 v13.97,145.73 | v71.44,147 72.71,145.73 72.71,107.95 A3.M2
  Bottom 0.203: v13.97,145.73 15.24,147 v71.44,147
N$120  (via drill 0.61)
  Top 0.203: v52.7,77.15 58.1,71.75 65.72,71.75 65.72,100.97 A3.N2
  Bottom 0.203: SIDE7.22 6.35,95.25 6.35,90.81 6.03,90.81 5.4,90.17 4.76,90.17 3.17,88.58 3.17,77.15 v52.7,77.15
N$121  (via drill 0.61)
  Top 0.203: SIDE7.24 15.88,102.23 15.88,131.44 22.23,137.79 v22.23,148.91 | v68.58,149.22 68.26,148.91 68.26,135.89 68.9,135.25 68.9,101.6 A3.P2
  Bottom 0.203: v22.23,148.91 22.54,149.22 v68.58,149.22
N$122  (via drill 0.61)
  Top 0.203: v57.15,82.87 v52.7,78.42 | v69.22,83.5 68.9,83.82 68.9,95.25 A3.R2
  Bottom 0.203: SIDE7.26 6.35,90.17 6.35,85.72 6.03,85.72 5.4,85.09 4.76,85.09 3.81,84.14 3.81,78.42 v52.7,78.42 | v57.15,82.87 57.47,82.55 68.26,82.55 v69.22,83.5
N$123  (via drill 0.61)
  Top 0.203: v69.22,147.96 68.9,147.64 68.9,135.89 69.53,135.25 69.53,102.87 72.07,100.33 72.07,94.61 A3.S2
  Bottom 0.203: SIDE7.28 8.89,90.17 8.89,102.87 4.76,102.87 2.22,105.41 2.22,147.96 v69.22,147.96
N$124  (via drill 0.61)
  Top 0.203: v55.56,79.38 56.52,80.33 56.52,80.96 59.37,83.82 v59.37,91.44
  Bottom 0.203: SIDE7.30 6.35,85.09 6.35,79.38 v55.56,79.38 | v59.37,91.44 66.36,91.44 A3.T2
N$125  (via drill 0.61)
  Top 0.203: v26.04,81.28 50.8,81.28 v50.8,99.69 | v68.9,98.42 69.53,97.79 69.53,88.27 A3.U2
  Bottom 0.203: v26.04,81.28 SIDE7.34 | v50.8,99.69 56.2,99.69 57.47,98.42 v68.9,98.42
N$126
  Bottom 0.203: SIDE7.32 53.02,83.82 54.29,85.09 62.55,85.09 63.82,83.82 A3.V2
N$127  (via drill 0.61)
  Top 0.203: v26.04,122.56 26.35,122.87 26.35,135.57 v34.61,143.83
  Bottom 0.203: v26.04,122.56 SIDE8.10 | v34.61,143.83 34.92,143.51 65.41,143.51 66.04,144.15 75.88,144.15 77.15,142.88 A3.A1
N$128  (via drill 0.61)
  Top 0.203: SIDE8.6 19.05,123.19 19.05,131.13 23.5,135.57 23.5,139.38 33.34,149.22 65.41,149.22 v65.41,139.38
  Bottom 0.203: v65.41,139.38 70.17,134.62 A3.B1
N$129  (via drill 0.61)
  Top 0.203: v27.94,124.14 29.21,125.41 29.21,136.53 v31.75,139.06
  Bottom 0.203: SIDE8.8 25.08,124.14 v27.94,124.14 | v31.75,139.06 32.7,140.02 38.1,140.02 38.42,139.7 60.64,139.7 72.07,128.27 A3.D1
N$130  (via drill 0.61)
  Top 0.203: SIDE8.12 19.05,113.03 19.05,111.44 20,110.49 26.99,110.49 26.99,135.57 33.34,141.92 v38.73,141.92
  Bottom 0.203: v38.73,141.92 39.05,142.24 72.07,142.24 75.25,139.06 75.25,135.89 75.88,135.25 75.88,125.09 A3.E1
N$131  (via drill 0.61)
  Top 0.203: SIDE8.14 25.08,116.52 v25.08,136.84
  Bottom 0.203: v25.08,136.84 28.89,140.65 38.1,140.65 38.42,140.34 70.17,140.34 75.25,135.25 75.25,121.92 A3.F1
N$132
  Bottom 0.203: SIDE8.16 29.21,118.11 30.8,118.11 31.75,119.06 31.75,120.02 32.07,120.02 32.7,120.65 46.35,120.65 46.99,120.02 56.83,120.02 57.47,120.65 72.71,120.65 74.61,118.75 A3.H1
N$133  (via drill 0.61)
  Top 0.203: v47.62,113.03 48.26,112.39 49.85,112.39 v49.85,116.52
  Bottom 0.203: SIDE8.20 29.21,113.03 v47.62,113.03 | v49.85,116.52 50.8,117.47 72.07,117.47 A3.J1
N$134  (via drill 0.61)
  Top 0.203: SIDE8.18 28.89,98.11 v28.89,91.44 | v51.75,90.49 52.07,90.81 v52.07,116.52
  Bottom 0.203: v28.89,91.44 30.16,90.17 51.44,90.17 v51.75,90.49 | v52.07,116.52 52.39,116.84 63.82,116.84 66.99,113.67 75.88,113.67 A3.K1
N$135  (via drill 0.61)
  Top 0.203: SIDE8.24 27.62,91.76 v27.62,91.44 | v53.34,89.53 53.34,92.08 52.7,92.71 52.7,96.84 57.47,101.6 62.55,101.6 62.55,105.41 v59.69,108.27
  Bottom 0.203: v27.62,91.44 29.53,89.53 v53.34,89.53 | v59.69,108.27 60.01,107.95 72.71,107.95 A3.L1
N$136  (via drill 0.61)
  Top 0.203: SIDE8.28 19.05,92.71 19.05,74.61 v22.54,71.12 | v73.66,70.17 75.88,72.39 75.88,104.78 A3.M1
  Bottom 0.203: v22.54,71.12 23.5,70.17 v73.66,70.17
N$137  (via drill 0.61)
  Top 0.203: v72.39,93.03 72.71,93.34 72.71,101.6 A3.N1
  Bottom 0.203: SIDE8.22 19.05,100.33 19.05,90.17 28.26,90.17 29.53,88.9 52.7,88.9 53.02,88.58 56.52,88.58 57.78,89.85 59.69,89.85 60.64,88.9 68.26,88.9 v72.39,93.03
N$138  (via drill 0.61)
  Top 0.203: v55.56,94.93 v53.66,93.03
  Bottom 0.203: SIDE8.30 21.59,92.71 45.09,92.71 45.72,93.34 53.34,93.34 v53.66,93.03 | v55.56,94.93 55.88,95.25 74.61,95.25 77.15,97.79 A3.P1
N$139
  Bottom 0.203: SIDE8.26 21.59,97.79 68.26,97.79 69.53,96.52 A3.R1
N$140  (via drill 0.61)
  Top 0.203: v26.99,82.23 SIDE8.32 | v57.47,80.33 60.01,82.87 60.01,85.09 v62.23,87.31
  Bottom 0.203: v26.99,82.23 27.3,81.92 48.9,81.92 50.48,80.33 v57.47,80.33 | v62.23,87.31 63.18,88.27 70.17,88.27 75.25,93.34 A3.S1
N$141  (via drill 0.61)
  Top 0.203: v51.75,84.77 52.7,83.82 v52.7,82.23
  Bottom 0.203: SIDE8.34 21.91,84.77 v51.75,84.77 | v52.7,82.23 53.02,81.92 70.17,81.92 73.98,85.72 77.79,85.72 78.42,86.36 78.42,90.17 A3.T1
N$142  (via drill 0.61)
  Top 0.203: SIDE8.4 24.13,128.27 24.13,139.38 33.34,148.59 51.44,148.59 51.44,120.97 63.18,109.22 v63.18,85.72
  Bottom 0.203: v63.18,85.72 73.34,85.72 74.61,87 A3.U1
N$143  (via drill 0.61)
  Top 0.203: v41.27,123.19 41.91,122.56 41.91,96.2 42.86,95.25 44.45,95.25 44.45,107 45.4,107.95 49.85,107.95 v49.85,107
  Bottom 0.203: SIDE8.2 22.23,125.09 28.26,125.09 30.16,123.19 v41.27,123.19 | v49.85,107 50.16,107.31 71.44,107.31 79.06,99.69 79.06,83.82 A3.V1
N$144
  Top 0.203: SIDE8.33 SIDE8.31 SIDE8.29 SIDE8.27 SIDE8.25 SIDE8.23 SIDE8.21 SIDE8.19 SIDE8.17 SIDE8.15 SIDE8.13 SIDE8.11 SIDE8.9 SIDE8.7 SIDE8.5 SIDE8.3 SIDE8.1
  Bottom 0.203: A3.C1 77.15,136.53 76.52,136.53 75.88,137.16 75.88,143.51 66.04,143.51 65.41,142.88 23.18,142.88 8.57,128.27 8.57,127 SIDE8.1
N$145  (via drill 0.61)
  Top 0.203: SIDE9.33 SIDE9.31 SIDE9.29 SIDE9.27 SIDE9.25 SIDE9.23 SIDE9.21 SIDE9.19 SIDE9.17 SIDE9.15 SIDE9.13 SIDE9.11 SIDE9.9 SIDE9.7 SIDE9.5 SIDE9.3 SIDE9.1 30.48,135.25 v32.07,136.84
  Bottom 0.203: A4.C2 59.37,132.72 61.28,132.72 62.55,133.99 62.55,136.53 47.94,136.53 46.04,138.43 33.66,138.43 v32.07,136.84
N$146  (via drill 0.61)
  Top 0.203: v33.02,139.06 SIDE9.2
  Bottom 0.203: v33.02,139.06 56.83,139.06 A4.A2
N$147
  Bottom 0.203: SIDE9.4 36.83,133.35 46.35,133.35 47.62,134.62 A4.B2
N$148
  Bottom 0.203: SIDE9.6 34.29,128.27 A4.D2
N$149
  Bottom 0.203: SIDE9.8 34.29,125.73 47.94,125.73 48.58,125.09 A4.E2
N$150
  Bottom 0.203: SIDE9.10 33.34,122.24 41.91,122.24 42.86,123.19 49.53,123.19 50.8,121.92 A4.F2
N$151
  Bottom 0.203: SIDE9.12 34.29,118.11 50.8,118.11 51.44,118.75 A4.H2
N$152
  Bottom 0.203: SIDE9.14 34.29,115.57 A4.J2
N$153  (via drill 0.61)
  Top 0.203: v36.83,110.49 SIDE9.16
  Bottom 0.203: v36.83,110.49 46.35,110.49 46.99,111.12 56.83,111.12 A4.K2
N$154
  Bottom 0.203: SIDE9.18 36.83,107.95 53.66,107.95 A4.L2
N$155  (via drill 0.61)
  Top 0.203: v53.02,102.87 54.29,101.6 56.83,101.6 56.83,104.78 A4.M2
  Bottom 0.203: SIDE9.20 31.75,107.95 31.75,105.41 33.66,105.41 36.2,102.87 v53.02,102.87
N$156  (via drill 0.61)
  Top 0.203: v53.98,105.09 54.93,104.14 A4.N2
  Bottom 0.203: SIDE9.22 34.29,105.41 52.39,105.41 52.7,105.09 v53.98,105.09
N$157
  Bottom 0.203: SIDE9.24 36.83,100.33 47.94,100.33 48.58,100.97 56.83,100.97 A4.P2
N$158  (via drill 0.61)
  Top 0.203: v39.37,95.25 SIDE9.26
  Bottom 0.203: v39.37,95.25 53.66,95.25 A4.R2
N$159  (via drill 0.61)
  Top 0.203: SIDE9.28 37.47,94.61 v37.47,87.95 | A4.S2 v58.1,88.9
  Bottom 0.203: v37.47,87.95 37.78,87.63 56.83,87.63 v58.1,88.9
N$160  (via drill 0.61)
  Top 0.203: A4.T2 v54.93,93.03
  Bottom 0.203: SIDE9.30 35.56,93.98 53.98,93.98 v54.93,93.03
N$161  (via drill 0.61)
  Top 0.203: SIDE9.34 35.56,88.9 v35.56,87.95
  Bottom 0.203: v35.56,87.95 36.51,87 A4.U2
N$162  (via drill 0.61)
  Top 0.203: SIDE9.32 36.51,90.49 v36.51,82.87
  Bottom 0.203: v36.51,82.87 36.83,83.19 54.29,83.19 A4.V2
N$163  (via drill 0.61)
  Top 0.203: v52.39,127.32 53.66,128.59 53.66,144.46 55.24,146.05 64.45,146.05 A4.A1
  Bottom 0.203: SIDE10.10 46.04,127.32 v52.39,127.32
N$164
  Bottom 0.203: SIDE10.6 46.99,133.35 60.01,133.35 A4.B1
N$165
  Bottom 0.203: SIDE10.8 60.01,129.54 A4.D1
N$166
  Bottom 0.203: SIDE10.12 56.83,124.46 57.47,123.83 63.18,123.83 A4.E1
N$167
  Bottom 0.203: SIDE10.14 46.99,120.65 56.83,120.65 58.1,121.92 A4.F1
N$168
  Bottom 0.203: SIDE10.16 56.83,119.38 57.47,120.02 63.18,120.02 A4.H1
N$169
  Bottom 0.203: SIDE10.20 60.01,114.3 A4.J1
N$170  (via drill 0.61)
  Top 0.203: SIDE10.18 48.9,113.67 v48.9,113.35
  Bottom 0.203: v48.9,113.35 49.21,113.67 63.18,113.67 A4.K1
N$171
  Bottom 0.203: SIDE10.24 46.99,110.49 60.01,110.49 A4.L1
N$172
  Bottom 0.203: SIDE10.28 59.37,104.14 61.28,106.05 A4.M1
N$173  (via drill 0.61)
  Top 0.203: v53.98,112.08 61.28,104.78 A4.N1
  Bottom 0.203: SIDE10.22 46.04,112.08 v53.98,112.08
N$174
  Bottom 0.203: SIDE10.30 62.55,101.6 A4.P1
N$175  (via drill 0.61)
  Top 0.203: SIDE10.26 48.9,103.5 v48.9,100.01 | v55.88,98.74 57.15,98.74 59.37,96.52 A4.R1
  Bottom 0.203: v48.9,100.01 50.16,98.74 v55.88,98.74
N$176  (via drill 0.61)
  Top 0.203: SIDE10.32 48.9,95.89 v48.9,92.39
  Bottom 0.203: v48.9,92.39 49.21,92.08 58.74,92.08 60.01,93.34 A4.S1
N$177  (via drill 0.61)
  Top 0.203: SIDE10.34 46.04,96.2 v46.04,92.39
  Bottom 0.203: v46.04,92.39 46.99,91.44 58.1,91.44 59.05,90.49 60.96,90.49 A4.T1
N$178  (via drill 0.61)
  Top 0.203: SIDE10.4 49.53,130.81 49.53,118.11 50.8,116.84 50.8,100.97 49.85,100.01 v49.85,86.04
  Bottom 0.203: v49.85,86.04 50.16,85.72 61.91,85.72 63.18,87 A4.U1
N$179  (via drill 0.61)
  Top 0.203: SIDE10.2 44.45,138.43 40.32,138.43 40.32,91.76 v49.85,82.23 | v59.37,80.96 61.28,82.87 A4.V1
  Bottom 0.203: v49.85,82.23 50.8,81.28 59.05,81.28 v59.37,80.96
N$180
  Top 0.203: SIDE10.1 SIDE10.3 SIDE10.5 SIDE10.7 SIDE10.9 SIDE10.11 SIDE10.13 SIDE10.15 SIDE10.17 SIDE10.19 SIDE10.21 SIDE10.23 SIDE10.25 SIDE10.27 SIDE10.29 SIDE10.31 SIDE10.33
  Bottom 0.203: A4.C1 63.18,130.18 46.67,130.18 46.04,130.81 45.4,130.81 44.13,132.08 SIDE10.5
N$181  (via drill 0.61)
  Top 0.203: SIDE11.33 SIDE11.31 SIDE11.29 SIDE11.27 SIDE11.25 SIDE11.23 SIDE11.21 SIDE11.19 SIDE11.17 SIDE11.15 SIDE11.13 SIDE11.11 SIDE11.9 SIDE11.7 SIDE11.5 SIDE11.3 SIDE11.1 137.16,64.45 v134.62,66.99
  Bottom 0.203: A6.C2 81.6,63.5 79.69,63.5 79.06,64.14 79.06,66.04 98.11,66.04 98.74,66.67 112.71,66.67 113.03,66.99 v134.62,66.99
N$182  (via drill 0.61)
  Top 0.203: SIDE11.2 139.06,64.14 v139.06,70.17
  Bottom 0.203: v139.06,70.17 138.75,70.48 104.78,70.48 104.14,71.12 92.71,71.12 92.39,71.44 86.68,71.44 83.5,68.26 A6.A2
N$183  (via drill 0.61)
  Top 0.203: SIDE11.4 138.43,62.23 138.43,64.45 v135.89,66.99 | v105.73,67.63 103.82,65.72 v103.82,60.33
  Bottom 0.203: v135.89,66.99 134.94,67.94 106.05,67.94 v105.73,67.63 | v103.82,60.33 86.68,60.33 82.23,64.77 A6.B2
N$184
  Bottom 0.203: SIDE11.6 138.43,59.69 124.14,59.69 122.87,58.42 101.28,58.42 100.01,59.69 81.6,59.69 A6.D2
N$185  (via drill 0.61)
  Top 0.203: SIDE11.8 140.97,57.15 v140.97,66.99 | v92.08,68.58 91.76,68.26 91.76,62.23 91.12,61.59 91.12,60.96 v85.72,55.56
  Bottom 0.203: v140.97,66.99 139.38,68.58 105.41,68.58 104.14,69.85 93.34,69.85 v92.08,68.58 | v85.72,55.56 85.41,55.24 A6.E2
N$186  (via drill 0.61)
  Top 0.203: v103.19,72.71 100.65,70.17 100.65,64.14 94.61,58.1 v94.61,56.83
  Bottom 0.203: SIDE11.10 148.59,62.23 152.72,62.23 153.67,63.18 153.67,74.3 104.14,74.3 103.19,73.34 v103.19,72.71 | v94.61,56.83 91.12,53.34 81.6,53.34 A6.F2
N$187  (via drill 0.61)
  Top 0.203: v131.44,57.47 131.76,57.78 131.76,64.45 118.11,78.11 108.58,78.11 108.58,79.38 107.95,80.01 106.68,80.01 v106.68,49.85
  Bottom 0.203: SIDE11.12 138.43,52.07 136.84,52.07 v131.44,57.47 | v106.68,49.85 106.36,50.16 87.31,50.16 86.04,48.9 A6.H2
N$188  (via drill 0.61)
  Top 0.203: SIDE11.14 138.43,46.99 138.43,45.4 139.38,44.45 145.1,44.45 v145.1,9.21 | v82.55,8.57 82.87,8.89 82.87,15.24 81.6,16.51 81.6,44.45 A6.J2
  Bottom 0.203: v145.1,9.21 140.34,4.45 137.79,4.45 137.16,3.81 87.31,3.81 v82.55,8.57
N$189  (via drill 0.61)
  Top 0.203: SIDE11.16 141.92,47.94 v141.92,67.94 | v85.09,68.58 84.77,68.26 84.77,43.81 A6.K2
  Bottom 0.203: v141.92,67.94 140.65,69.22 105.41,69.22 104.14,70.48 92.71,70.48 92.39,70.8 87.31,70.8 v85.09,68.58
N$190  (via drill 0.61)
  Top 0.203: SIDE11.18 144.15,43.18 v144.15,10.16 | v78.11,14.29 78.42,14.61 78.42,33.66 78.11,33.97 78.11,35.24 80.33,37.47 A6.L2
  Bottom 0.203: v144.15,10.16 139.06,5.08 137.79,5.08 137.16,4.45 87.95,4.45 v78.11,14.29
N$191  (via drill 0.61)
  Top 0.203: SIDE11.20 141.6,38.73 v141.6,2.22 | v84.77,2.22 84.77,34.92 A6.M2
  Bottom 0.203: v141.6,2.22 140.65,1.27 85.72,1.27 v84.77,2.22
N$192  (via drill 0.61)
  Top 0.203: v136.21,36.83 135.89,36.51 135.89,6.35 v136.84,5.4 | v89.53,15.56 v89.53,9.53
  Bottom 0.203: SIDE11.22 138.43,36.83 v136.21,36.83 | v136.84,5.4 136.53,5.08 93.98,5.08 v89.53,9.53 | v89.53,15.56 79.06,26.04 79.06,33.02 A6.N2
N$193  (via drill 0.61)
  Top 0.203: SIDE11.24 138.43,36.83 138.43,40.96 139.38,41.91 142.24,41.91 142.24,3.49 v142.56,3.17 | v86.04,2.22 85.41,2.86 85.41,27.94 v85.72,28.26
  Bottom 0.203: v142.56,3.17 140.97,3.17 139.7,1.91 86.36,1.91 v86.04,2.22 | v85.72,28.26 84.14,29.84 A6.P2
N$194  (via drill 0.61)
  Top 0.203: SIDE11.26 140.97,31.75 140.97,10.79 v140.34,10.16 | v91.12,9.21 91.12,19.05 v88.27,21.91
  Bottom 0.203: v140.34,10.16 135.89,5.71 94.61,5.71 v91.12,9.21 | v88.27,21.91 83.5,26.67 A6.R2
N$195  (via drill 0.61)
  Top 0.203: v143.19,4.45 v143.19,30.16 | v83.19,6.67 83.5,6.99 83.5,15.24 82.23,16.51 82.23,22.23 A6.S2
  Bottom 0.203: SIDE11.28 140.02,30.16 v143.19,30.16 | v143.19,4.45 142.88,4.13 140.97,4.13 140.65,3.81 138.11,3.81 137.48,3.17 87,3.17 83.5,6.67 v83.19,6.67
N$196  (via drill 0.61)
  Top 0.203: v133.35,26.67 131.13,24.45 v131.13,15.56 | v81.92,12.06 81.6,12.38 81.6,15.88 80.33,17.14 A6.T2
  Bottom 0.203: SIDE11.30 138.43,26.67 v133.35,26.67 | v131.13,15.56 129.54,13.97 113.98,13.97 113.03,13.02 113.03,11.43 96.84,11.43 96.2,12.06 v81.92,12.06
N$197  (via drill 0.61)
  Top 0.203: SIDE11.34 139.38,22.54 v139.38,2.86 | v83.82,5.08 84.14,5.4 84.14,16.51 A6.U2
  Bottom 0.203: v139.38,2.86 139.06,2.54 87,2.54 84.45,5.08 v83.82,5.08
N$198  (via drill 0.61)
  Top 0.203: SIDE11.32 138.43,24.13 v138.43,15.56 | v118.11,12.7 117.16,11.75 117.16,11.11 115.89,9.84 109.86,9.84 109.86,12.06 v109.54,12.38
  Bottom 0.203: v138.43,15.56 135.57,12.7 v118.11,12.7 | v109.54,12.38 109.22,12.7 82.55,12.7 81.28,13.97 A6.V2
N$199  (via drill 0.61)
  Top 0.203: SIDE12.10 156.21,62.23 156.21,138.43 v154.31,140.34 | v109.86,143.83 107.31,141.29 107.31,124.14 103.19,120.02 97.47,120.02 97.47,117.47 95.57,115.57 95.57,113.67 94.3,112.39 94.3,100.97 91.12,97.79 91.12,78.74 89.85,77.47 A6.A1
  Bottom 0.203: v154.31,140.34 153.99,140.65 133.35,140.65 129.86,144.15 110.17,144.15 v109.86,143.83
N$200  (via drill 0.61)
  Top 0.203: SIDE12.6 153.67,64.77 153.67,72.71 144.78,81.6 v144.78,110.81 | v120.97,118.11 120.02,119.06 120.02,137.79 114.62,143.19 114.62,143.51 112.08,146.05 98.42,146.05 98.42,138.75 98.74,138.43 98.74,135.89 94.3,131.44 94.3,120.02 91.12,116.84 91.12,110.49 88.58,107.95 88.58,67.31 86.68,65.41 A6.B1
  Bottom 0.203: v144.78,110.81 142.56,113.03 132.4,113.03 127.32,118.11 v120.97,118.11
N$201  (via drill 0.61)
  Top 0.203: SIDE12.8 151.13,62.23 v151.13,69.53 | v113.98,72.07 107.63,78.42 v107.63,79.06 | v102.55,77.79 103.5,78.74 v103.5,82.87
  Bottom 0.203: v151.13,69.53 149.54,71.12 114.94,71.12 v113.98,72.07 | v107.63,79.06 107.31,78.74 103.5,78.74 v102.55,77.79 | v103.5,82.87 103.19,82.55 85.41,82.55 85.09,82.87 81.92,82.87 73.98,74.93 73.98,71.75 75.25,71.75 78.42,68.58 78.42,62.87 79.06,62.23 79.06,57.15 85.41,57.15 A6.D1
N$202  (via drill 0.61)
  Top 0.203: v136.21,49.53 134.3,47.62 134.3,14.61 121.92,2.22 87.95,2.22 87.95,15.24 v86.36,16.83
  Bottom 0.203: SIDE12.12 151.13,54.61 145.1,54.61 140.02,49.53 v136.21,49.53 | v86.36,16.83 78.42,24.77 78.42,33.66 77.79,33.66 75.88,35.56 75.88,41.27 77.79,41.27 79.06,42.55 79.06,53.98 88.58,53.98 A6.E1
N$203  (via drill 0.61)
  Top 0.203: v126.05,19.05 125.73,18.73 125.73,12.38 116.2,2.86 100.97,2.86 v100.97,7.94 | v99.69,9.21 98.11,10.79 98.11,26.04 v95.89,28.26 | v87,43.5 85.41,45.09 85.41,50.8 A6.F1
  Bottom 0.203: SIDE12.14 153.67,52.07 153.67,29.21 152.08,29.21 151.13,28.26 151.13,27.3 150.81,27.3 142.56,19.05 v126.05,19.05 | v99.69,9.21 v100.97,7.94 | v95.89,28.26 91.12,33.02 91.12,41.27 89.22,41.27 v87,43.5
N$204  (via drill 0.61)
  Top 0.203: SIDE12.16 154.62,48.58 v154.62,28.57 | v120.02,11.75 114.3,6.03 106.05,6.03 v106.05,6.67 | v94.93,6.67 94.93,45.72 91.76,48.9 A6.H1
  Bottom 0.203: v154.62,28.57 137.79,11.75 v120.02,11.75 | v106.05,6.67 105.73,6.35 95.25,6.35 v94.93,6.67
N$205
  Bottom 0.203: SIDE12.20 151.13,46.99 105.09,46.99 103.82,45.72 101.28,45.72 100.01,46.99 87.95,46.99 A6.J1
N$206  (via drill 0.61)
  Top 0.203: SIDE12.18 151.13,46.99 v151.13,12.06 | v120.65,9.84 115.57,4.76 103.82,4.76 103.82,26.67 101.28,29.21 v101.28,34.29
  Bottom 0.203: v151.13,12.06 150.18,11.11 128.27,11.11 127,9.84 v120.65,9.84 | v101.28,34.29 97.47,38.1 92.39,38.1 91.76,38.73 91.76,42.55 A6.K1
N$207  (via drill 0.61)
  Top 0.203: SIDE12.24 153.67,39.37 153.67,13.02 141.92,1.27 79.06,1.27 v79.06,34.29
  Bottom 0.203: v79.06,34.29 84.14,39.37 A6.L1
N$208  (via drill 0.61)
  Top 0.203: v119.7,31.75 119.06,31.11 119.06,11.43 116.52,8.89 109.22,8.89 109.22,11.43 108.58,12.06 v108.58,22.54
  Bottom 0.203: SIDE12.28 151.13,34.29 148.59,34.29 146.05,31.75 v119.7,31.75 | v108.58,22.54 108.27,22.23 99.38,22.23 96.2,25.4 92.39,25.4 88.58,29.21 88.58,36.2 A6.M1
N$209  (via drill 0.61)
  Top 0.203: v132.72,44.45 132.4,44.77 132.4,68.9 122.24,79.06 122.24,99.69 120.02,101.92 117.16,101.92 117.16,87.95 113.35,84.14 111.76,84.14 v111.76,91.76 | v93.34,92.39 91.76,90.81 v91.76,78.11 | v86.68,73.03 82.23,68.58 82.23,39.37 86.68,34.92 A6.N1
  Bottom 0.203: SIDE12.22 151.13,44.45 v132.72,44.45 | v111.76,91.76 111.44,91.44 107.95,91.44 107.31,92.08 93.66,92.08 v93.34,92.39 | v86.68,73.03 v91.76,78.11
N$210  (via drill 0.61)
  Top 0.203: v120.97,20.95 120.97,11.43 119.7,10.16 119.7,9.53 115.57,5.4 104.78,5.4 v104.78,7.3 | v93.98,8.89 94.3,9.21 94.3,27.3 v92.08,29.53
  Bottom 0.203: SIDE12.30 151.13,31.75 146.69,31.75 144.15,29.21 132.4,29.21 127.32,24.13 124.14,24.13 v120.97,20.95 | v104.78,7.3 104.46,6.99 95.89,6.99 v93.98,8.89 | v92.08,29.53 91.76,29.84 A6.P1
N$211  (via drill 0.61)
  Top 0.203: v122.24,41.27 122.56,41.59 v122.56,59.37 | v102.23,59.37 100.01,57.15 95.57,57.15 v95.57,57.78 | v88.9,52.39 v91.44,54.93
  Bottom 0.203: SIDE12.26 151.13,39.37 124.14,39.37 v122.24,41.27 | v102.23,59.37 v122.56,59.37 | v95.57,57.78 94.3,57.78 v91.44,54.93 | v88.9,52.39 86.68,50.16 82.87,50.16 82.23,49.53 82.23,40.64 87.31,40.64 87.95,40.01 87.95,29.53 87.63,29.53 86.68,28.57 A6.R1
N$212  (via drill 0.61)
  Top 0.203: v121.92,19.37 121.6,19.05 121.6,9.53 116.2,4.13 103.19,4.13 103.19,12.38 v99.06,16.51
  Bottom 0.203: SIDE12.32 151.13,29.21 147.64,29.21 139.38,20.95 127.95,20.95 127.32,21.59 124.14,21.59 v121.92,19.37 | v99.06,16.51 96.52,19.05 92.39,19.05 91.76,19.68 91.76,20.95 92.08,21.27 92.08,23.5 A6.S1
N$213  (via drill 0.61)
  Top 0.203: v118.11,16.51 116.52,14.92 116.52,11.11 115.89,10.48 110.49,10.48 110.49,13.97 v109.54,14.92 | v92.71,15.56 91.76,14.61 91.76,9.84 92.08,9.53 92.08,8.89 91.44,8.26 88.58,8.26 88.58,15.88 86.68,17.78 A6.T1
  Bottom 0.203: SIDE12.34 140.97,16.51 v118.11,16.51 | v109.54,14.92 108.9,15.56 v92.71,15.56
N$214  (via drill 0.61)
  Top 0.203: v119.7,62.23 115.25,57.78 115.25,53.98 115.57,53.66 115.57,47.94 114.62,46.99 113.03,46.99 113.03,45.4 112.08,44.45 110.81,44.45 110.81,44.13 v108.58,41.91 | v93.34,43.81 88.58,39.05 88.58,29.21 88.9,28.89 88.9,25.4 87.31,23.81 87.31,21.59 89.85,19.05 A6.U1
  Bottom 0.203: SIDE12.4 151.13,64.77 132.72,64.77 130.18,62.23 v119.7,62.23 | v108.58,41.91 108.27,42.23 104.78,42.23 103.19,43.81 v93.34,43.81
N$215  (via drill 0.61)
  Top 0.203: v126.36,66.04 120.02,59.69 120.02,37.15 114.62,31.75 107,31.75 v107,39.69 | v93.03,41.27 91.12,39.37 v91.12,21.59
  Bottom 0.203: SIDE12.2 151.13,67.31 142.56,67.31 141.29,66.04 v126.36,66.04 | v107,39.69 105.41,41.27 v93.03,41.27 | v91.12,21.59 91.12,13.97 A6.V1
N$216  (via drill 0.61)
  Top 0.203: SIDE12.33 SIDE12.31 SIDE12.29 SIDE12.27 SIDE12.25 SIDE12.23 SIDE12.21 SIDE12.19 SIDE12.17 SIDE12.15 SIDE12.13 SIDE12.11 SIDE12.9 SIDE12.7 SIDE12.5 SIDE12.3 SIDE12.1 v140.97,77.47 | A6.C1 91.12,62.87 91.12,70.17 91.76,70.8 93.66,70.8 93.98,70.48 100.33,70.48 100.33,70.8 102.23,72.71 102.23,73.03 103.82,74.61 v103.82,76.52